# EAGLE design BJ_GIRA_Taster (EAGLE 5.04)
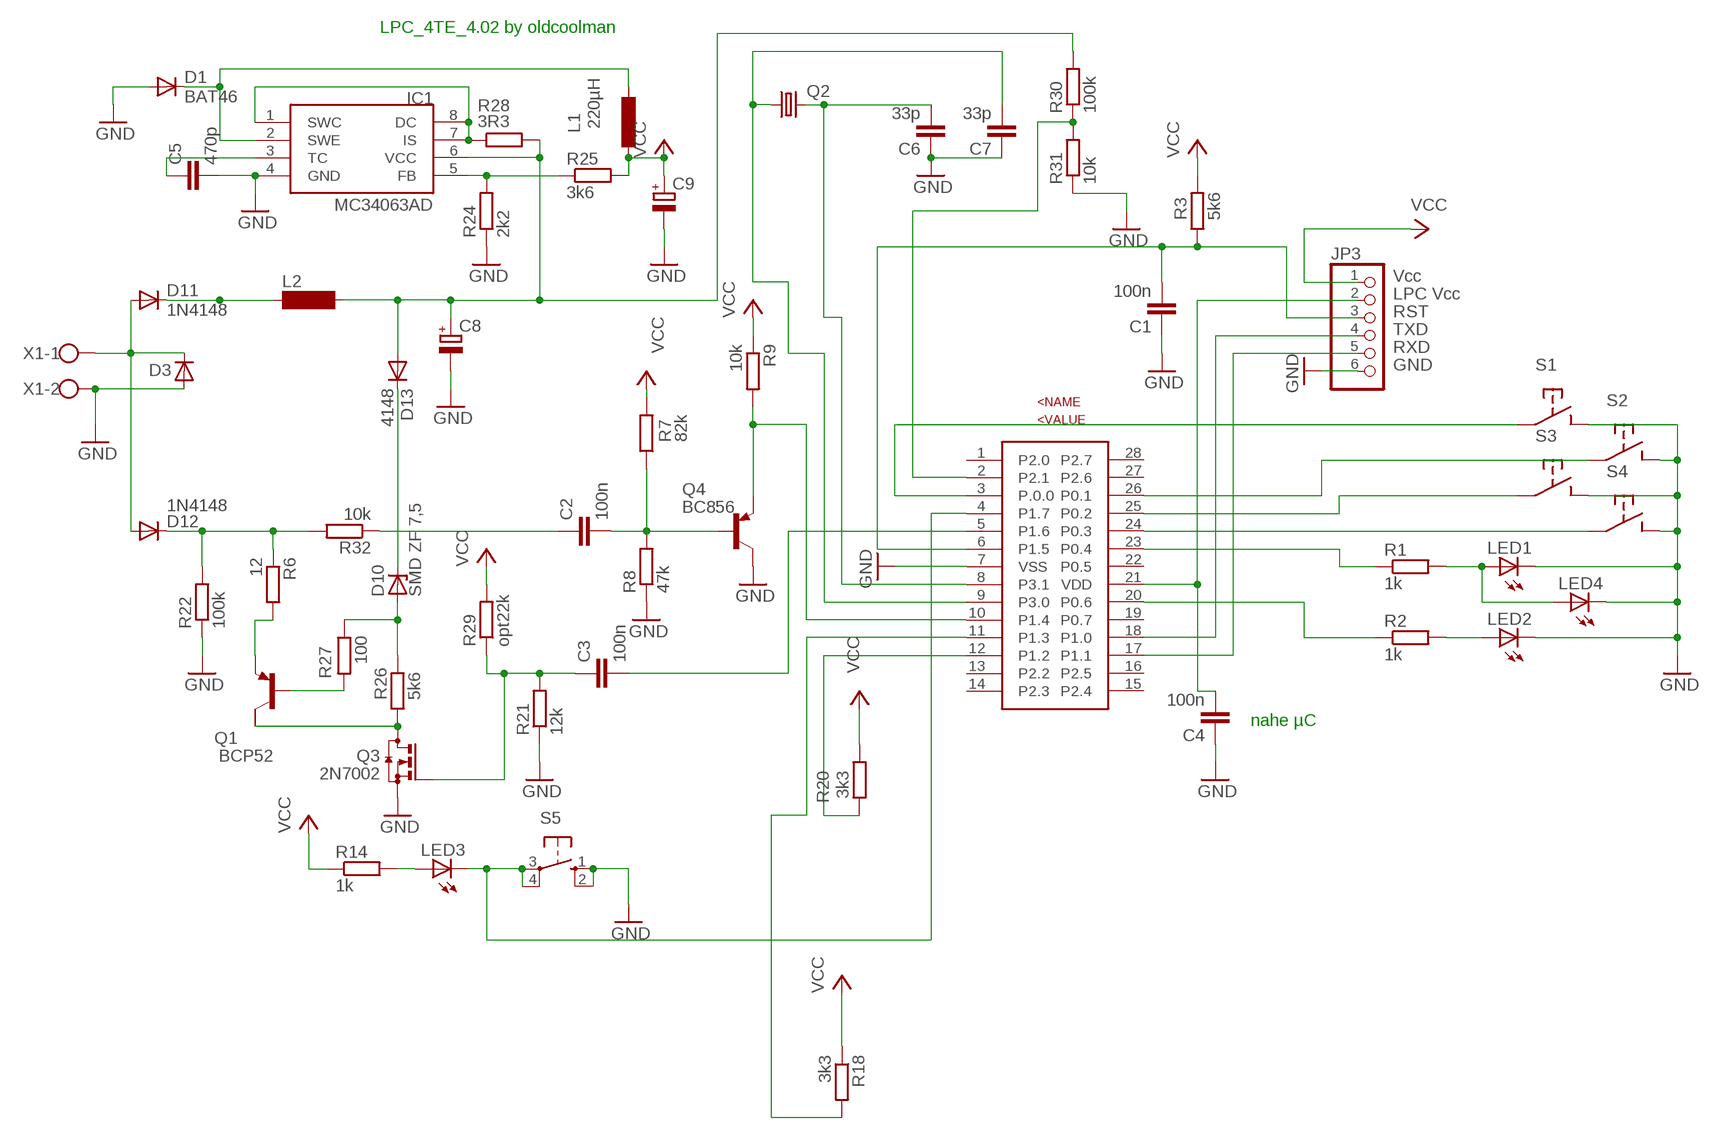
[diagram p0: schematic, sheet 1]

## Parts
C1  100n  C-EUC1206  [C1206]
C2  100n  C-EUC1206  [C1206]
C3  100n  C-EUC1206  [C1206]
C4  100n  C-EUC1206  [C1206]
C5  470p  C-EUC1206  [C1206]
C6  33p  C-EUC1206  [C1206]
C7  33p  C-EUC1206  [C1206]
C8  CPOL-EUE3.5-8  [E3,5-8]
C9  CPOL-EUE2.5-5  [E2,5-5]
D1  BAT46  DIODE-MINIMELF  [MINIMELF]
D3  D-SMB  [SMB]
D10  SMD ZF 7,5  ZPD  [MINIMELF]
D11  1N4148  DIODE-MINIMELF  [MINIMELF]
D12  1N4148  DIODE-MINIMELF  [MINIMELF]
D13  4148  DIODE-MINIMELF  [MINIMELF]
IC1  MC34063AD  [SOIC8]
JP3  PINHD-1X6  [1X06]
L1  220µH  L-EU2200-11.43  [2200-11.43]
L2  BS11  [BS11]
LED1  LED3MM  [LED3MM]
LED2  LED3MM  [LED3MM]
LED3  LED3MM  [LED3MM]
LED4  LED3MM  [LED3MM]
Q1  BCP52  FZT753SMD  [SOT223]
Q2  CRYSTALHC49U-V  [HC49U-V]
Q3  2N7002  BSS123  [SOT23]
Q4  BC856  BC856ALT1SMD  [SOT23-BEC]
R1  1k  R-EU_R1206  [R1206]
R2  1k  R-EU_R1206  [R1206]
R3  5k6  R-EU_M1206  [M1206]
R6  12  R-EU_R1206  [R1206]
R7  82k  R-EU_R1206  [R1206]
R8  47k  R-EU_M1206  [M1206]
R9  10k  R-EU_R1206  [R1206]
R14  1k  R-EU_R1206  [R1206]
R18  3k3  R-EU_R1206  [R1206]
R20  3k3  R-EU_M1206  [M1206]
R21  12k  R-EU_R1206  [R1206]
R22  100k  R-EU_M1206  [M1206]
R24  2k2  R-EU_R1206  [R1206]
R25  3k6  R-EU_M1206  [M1206]
R26  5k6  R-EU_M1206  [M1206]
R27  100  R-EU_R1206  [R1206]
R28  3R3  R-EU_M1206  [M1206]
R29  opt22k  R-EU_R1206  [R1206]
R30  100k  R-EU_R1206  [R1206]
R31  10k  R-EU_R1206  [R1206]
R32  10k  R-EU_R1206  [R1206]
S1  3305  [3305]
S2  3305  [3305]
S3  3305  [3305]
S4  3305  [3305]
S5  10-XX  [B3F-10XX]
U$1  LPC936TSSOP28  [TSSOP28]
X1  W237-02P  [W237-132]

## Nets
EIB+: D3.1(C) D11.A D12.A X1.1
GND: C1.1 C4.1 C5.2 C6.1 C7.1 C8.- C9.- D1.A D3.2(A) IC1.4(GND) JP3.6 LED1.K(C) LED2.K(C) LED4.K(C) Q3.2(S) Q4.C R8.1 R21.1 R22.1 R24.1 R31.1 S1.P$2 S2.P$2 S3.P$2 S4.P$2 S5.1(S) S5.2(S1) U$1.7(VSS) X1.2
N$1: LED1.A LED4.A R1.2
N$2: LED2.A R2.2
N$7: LED3.K(C) S5.3(P) S5.4(P1) U$1.4(P1.7)
N$9: LED3.A R14.2
N$30: Q4.E R9.2 U$1.10(P1.4)
N$31: C2.2 Q4.B R7.1 R8.2
N$33: C3.2 U$1.5(P1.6)
N$34: D12.C R6.1 R22.2 R32.2
N$41: JP3.5 U$1.17(P1.1)
N$42: C1.2 JP3.3 R3.1 U$1.6(P1.5)
N$43: JP3.4 U$1.18(P1.0)
N$44: C4.2 JP3.2 U$1.21(VDD)
N$47: R18.2 U$1.11(P1.3)
N$48: C3.1 Q3.1(G) R21.2 R29.1
N$50: IC1.5(FB) R24.2 R25.1
N$51: D1.C IC1.2(SWE) L1.2
N$52: C5.1 IC1.3(TC)
N$53: D11.C L2.1
N$54: Q1.2(C) Q3.3(D) R26.1
N$55: D10.A R26.2 R27.1
N$56: Q1.3(E) R6.2
N$57: Q1.1(B) R27.2
N$58: D10.C D13.C
N$59: C6.2 Q2.2 U$1.8(P3.1)
N$63: IC1.1(SWC) IC1.7(IS) IC1.8(DC) R28.1
N$71: R20.2 U$1.12(P1.2)
N$72: C8.+ D13.A IC1.6(VCC) L2.2 R28.2 R30.2
N$75: R30.1 R31.2 U$1.2(P2.1)
N$76: C7.2 Q2.1 U$1.9(P3.0)
N$77: C2.1 R32.1
P0.0: S1.P$1 U$1.3(P.0.0)
P0.1: S2.P$1 U$1.26(P0.1)
P0.2: S3.P$1 U$1.25(P0.2)
P0.3: S4.P$1 U$1.24(P0.3)
P0.4: R1.1 U$1.23(P0.4)
P0.6: R2.1 U$1.20(P0.6)
VCC: C9.+ JP3.1 L1.1 R3.2 R7.2 R9.1 R14.1 R18.1 R20.1 R25.2 R29.2
Unconnected: Q1.4(C/) U$1.1(P2.0) U$1.13(P2.2) U$1.14(P2.3) U$1.15(P2.4) U$1.16(P2.5) U$1.19(P0.7) U$1.22(P0.5) U$1.27(P2.6) U$1.28(P2.7)

## Notes on the sheet
- LPC_4TE_4.02 by oldcoolman
- Vcc
- LPC Vcc
- RST
- TXD
- RXD
- GND
- nahe µC

## Library data of the parts
C1-C7 = rcl:C-EU: CAPACITOR, European symbol
C8 C9 = rcl:CPOL-EU: POLARIZED CAPACITOR, European symbol
D1 D11-D13 = diode:DIODE-: DIODE
D3 = semicon-smd-ipc:D-: DIODE unfilled
D10 = diode:ZPD: Z DIODE 500 mW
IC1 = mc34063:MC34063
JP3 = pinhead:PINHD-1X6: PIN HEADER
L1 = rcl:L-EU: INDUCTOR, European symbol
L2 = inductor-neosid:BS: INDUCTOR nominal inductance, magnetically screened
LED1-LED4 = led:LED: LED OSRAM: - CHIPLED LG R971, LG N971, LY N971, LG Q971, LY Q971, LO R971, LY R971 LH N974, LH R974 LS Q976, LO Q976, LY Q976 LO Q996 - Hyper CHIPLED LW Q18S LB Q993, LB Q99A, LB R99A - SideLED LS A670, LO A670, LY A670, LG A670, LP A670 LB A673, LV A673, LT A673, LW A673 LH A674 LY A675 LS A676, LA A676, LO A676, LY A676, LW A676 LS A679, LY A679, LG A679 - Hyper Micro SIDELED® LS Y876, LA Y876, LO Y876, LY Y876 LT Y87S - SmartLED LW L88C, LW L88S LB L89C, LB L89S, LG L890 LS L89K, LO L89K, LY L89K LS L896, LA L896, LO L896, LY L896 - TOPLED LS T670, LO T670, LY T670, LG T670, LP T670 LSG T670, LSP T670, LSY T670, LOP T670, LYG T670 LG T671, LOG T671, LSG T671 LB T673, LV T673, LT T673, LW T673 LH T674 LS T676, LA T676, LO T676, LY T676, LB T676, LH T676, LSB T676, LW T676 LB T67C, LV T67C, LT T67C, LS T67K, LO T67K, LY T67K, LW E67C LS E67B, LA E67B, LO E67B, LY E67B, LB E67C, LV E67C, LT E67C LW T67C LS T679, LY T679, LG T679 LS T770, LO T770, LY T770, LG T770, LP T770 LB T773, LV T773, LT T773, LW T773 LH T774 LS E675, LA E675, LY E675, LS T675 LS T776, LA T776, LO T776, LY T776, LB T776 LHGB T686 LT T68C, LB T68C - Hyper Mini TOPLED® LB M676 - Mini TOPLED Santana® LG M470 LS M47K, LO M47K, LY M47K Source: http://www.osram.convergy.de - LUMILED® LXK2-PW12-R00, LXK2-PW12-S00, LXK2-PW14-U00, LXK2-PW14-V00 LXK2-PM12-R00, LXK2-PM12-S00, LXK2-PM14-U00 LXK2-PE12-Q00, LXK2-PE12-R00, LXK2-PE12-S00, LXK2-PE14-T00, LXK2-PE14-U00 LXK2-PB12-K00, LXK2-PB12-L00, LXK2-PB12-M00, LXK2-PB14-N00, LXK2-PB14-P00, LXK2-PB14-Q00 LXK2-PR12-L00, LXK2-PR12-M00, LXK2-PR14-Q00, LXK2-PR14-R00 LXK2-PD12-Q00, LXK2-PD12-R00, LXK2-PD12-S00 LXK2-PH12-R00, LXK2-PH12-S00 LXK2-PL12-P00, LXK2-PL12-Q00, LXK2-PL12-R00 Source: www.luxeon.com
Q1 = transistor-pnp:FZT753SMD: PNP Transistor
Q2 = crystal:CRYSTAL: CRYSTAL
Q3 = transistor-small-signal:BSS123: N-CHANNEL MOS FET
Q4 = transistor-pnp:BC856*: PNP Transistror
R1-R3 R6-R9 R14 R18 R20-R22 R24-R32 = rcl:R-EU_: RESISTOR, European symbol
S1-S4 = kubi:3305: Taster 3305
S5 = switch-omron:10-XX: OMRON SWITCH
U$1 = freebuslpc:LPC936: C51 Based Microcontroller LPC936 ADC and 16kbyte Flash
X1 = con-wago-508:W237-02P: WAGO SREW CLAMP

## Board
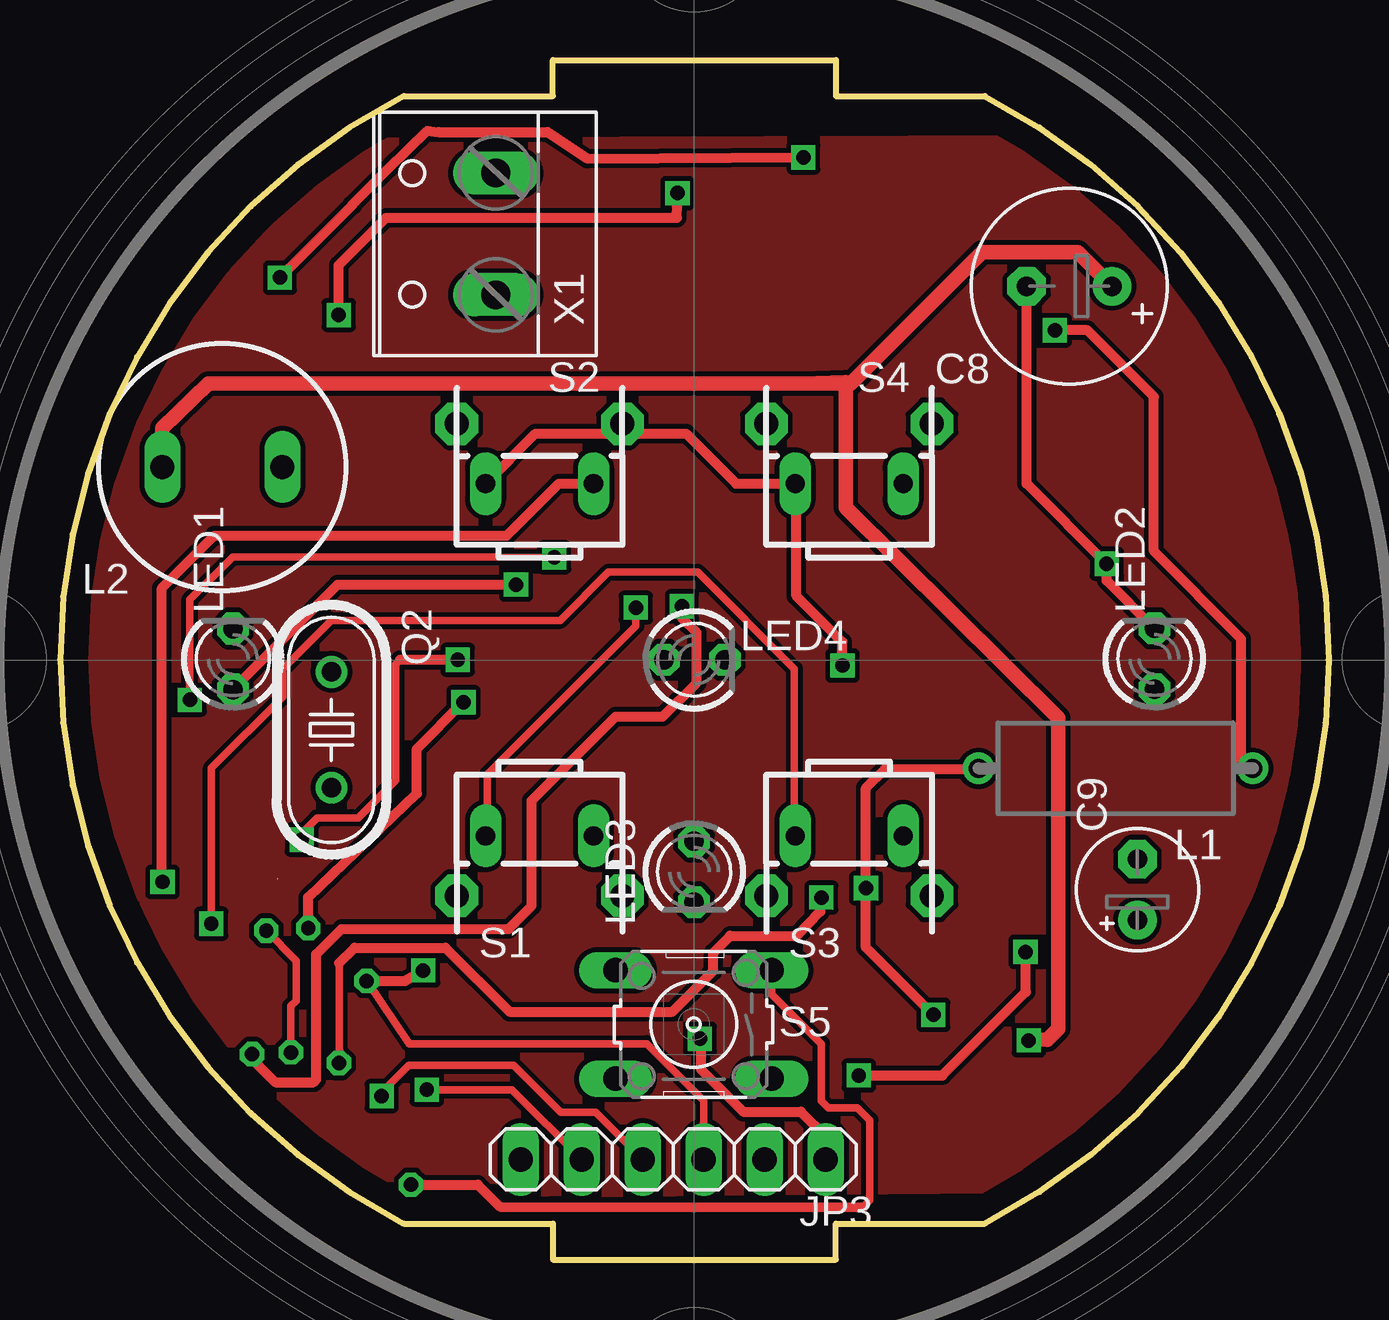
[diagram p1: board, top side]
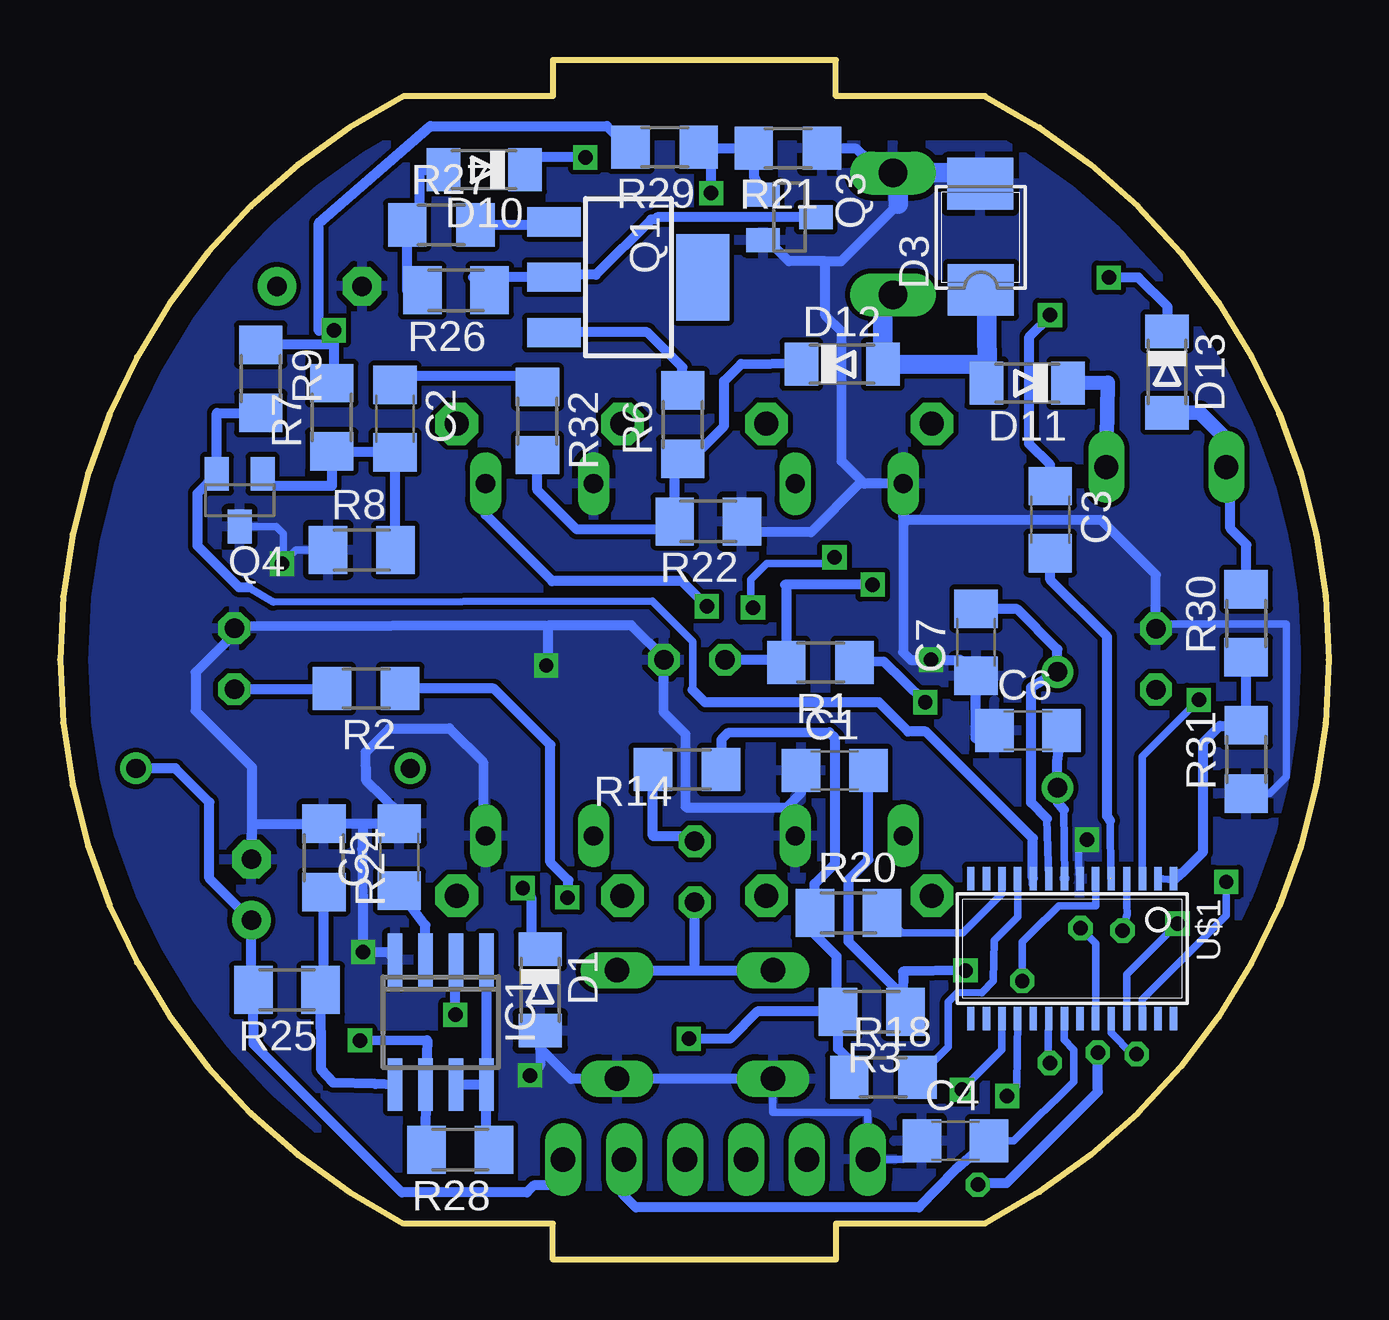
[diagram p2: board, bottom side, seen from below]

Size 52.86 x 50 mm. Coordinates in mm from the lower left corner, seen from the top.
Outline: 20.53,48.5 20.53,50 32.33,50 32.33,48.5 38.53,48.5 arc-126 38.53,1.5 32.33,1.5 32.33,0 20.53,0 20.53,1.5 14.33,1.5 arc-126 14.33,48.5 20.53,48.5
Copper layers (1*16): Top 0.035mm / dielectric 1.5mm / Bottom 0.035mm
Design rules "default": minimum track width 10mil, minimum drill 24mil, track to track 8mil, track to pad 8mil, pad to pad 8mil, via to via 8mil, smd to smd 8mil, copper to edge 40mil, drill to drill 8mil, minimum pad ring 10mil, minimum via ring 8mil, stop-mask expansion 4mil, vias tented up to drill 0mil, thermal gap 10mil
tKeepout: area 3.2,37.4 to 11.1,41.4; area 41.9,37.4 to 49.5,41.4; area 4.1,9.5 to 11.6,13.4; area 41.9,8.6 to 49.5,12.6

### Footprints (pad centres in the part's own frame; a part is rotated, then mirrored left to right if it is on the bottom)
C1206 = smd 1.6 x 1.8: 1 -1.4,0; 2 1.4,0
E3,5-8 = drill 0.813 pad 1.6 round: + -1.778,0 | drill 0.813 pad 1.6 octagon: - 1.778,0
E2,5-5 = drill 0.813 pad 1.6 round: + -1.27,0 | drill 0.813 pad 1.6 octagon: - 1.27,0
MINIMELF = smd 1.4 x 1.8: A 1.7,0; C -1.7,0
SMB = smd 2.159 x 2.743: 1 -2.311,-0.127; 2 2.108,-0.102
SOIC8 = smd 0.6 x 2.2: 1 -1.905,-2.6; 2 -0.635,-2.6; 3 0.635,-2.6; 4 1.905,-2.6; 5 1.905,2.6; 6 0.635,2.6; 7 -0.635,2.6; 8 -1.905,2.6
1X06 = drill 1.016 long: 1 -6.35,0; 2 -3.81,0; 3 -1.27,0; 4 1.27,0; 5 3.81,0; 6 6.35,0
2200-11.43 = drill 0.8 pad 1.27 round: 1 -5.715,0; 2 5.715,0
BS11 = drill 1 long: 1 -2.5,0; 2 2.5,0
LED3MM = drill 0.813 octagon: A -1.27,0; K 1.27,0
SOT223 = smd 1.219 x 2.235: 1 -2.311,-3.099; 2 0,-3.099; 3 2.311,-3.099 | smd 3.6 x 2.2: 4 0,3.099
HC49U-V = drill 0.813 round: 1 -2.413,0; 2 2.413,0
SOT23 = smd 1 x 1.4: 1 -0.95,-1.1; 2 0.95,-1.1; 3 0,1.1
SOT23-BEC = smd 1 x 1.4: B -0.95,-1.1; C 0,1.1; E 0.95,-1.1
R1206 = smd 1.6 x 1.803: 1 -1.422,0; 2 1.422,0
M1206 = smd 1.6 x 2: 1 -1.4,0; 2 1.4,0
3305 = drill 0.8 long: P$1 -2.25,0; P$2 2.25,0 | drill 1 pad 1.778 octagon: P$3 -3.45,-2.5; P$4 3.45,-2.5
B3F-10XX = drill 1.016 long: 1 -3.251,2.261; 2 3.251,2.261; 3 -3.251,-2.261; 4 3.251,-2.261
TSSOP28 = smd 0.305 x 0.991: 1 -4.225,-2.918; 2 -3.575,-2.918; 3 -2.925,-2.918; 4 -2.275,-2.918; 5 -1.625,-2.918; 6 -0.975,-2.918; 7 -0.325,-2.918; 8 0.325,-2.918; 9 0.975,-2.918; 10 1.625,-2.918; 11 2.275,-2.918; 12 2.925,-2.918; 13 3.575,-2.918; 14 4.225,-2.918; 15 4.225,2.918; 16 3.575,2.918; 17 2.925,2.918; 18 2.275,2.918; 19 1.625,2.918; 20 0.975,2.918; 21 0.325,2.918; 22 -0.325,2.918; 23 -0.975,2.918; 24 -1.625,2.918; 25 -2.275,2.918; 26 -2.925,2.918; 27 -3.575,2.918; 28 -4.225,2.918
W237-132 = drill 1.194 long: 1 -2.54,-0.635; 2 2.54,-0.635

### Placement (x,y rotation side)
C1  20.58,20.39 0 bottom
C2  38.91,35.05 270 bottom
C3  11.6,30.84 270 bottom
C4  15.55,4.95 0 bottom
C5  38.72,16.77 90 bottom
C6  12.53,22.05 0 bottom
C7  14.7,25.73 90 bottom
C8  42.05,40.57 180 top
C9  44.89,15.41 90 top
D1  32.86,11.24 270 bottom
D3  14.62,42.73 90 bottom
D10  35.19,45.42 180 bottom
D11  12.56,36.53 180 bottom
D12  20.28,37.32 0 bottom
D13  6.74,36.99 270 bottom
IC1  37,9.89 180 bottom
JP3  25.55,4.17 180 top
L1  43.98,20.47 180 top
L2  6.76,33.04 180 top
LED1  7.2,25.03 90 top
LED2  45.6,25.04 90 top
LED3  26.42,16.16 270 top
LED4  26.43,25 0 top
Q1  29.18,40.94 270 bottom
Q2  11.31,22.08 270 top
Q3  22.47,43.44 270 bottom
Q4  45.38,31.65 180 bottom
R1  21.18,24.89 180 bottom
R2  40.11,23.8 180 bottom
R3  19.04,10.33 180 bottom
R6  26.92,34.8 90 bottom
R7  41.54,35.11 90 bottom
R8  40.29,29.58 0 bottom
R9  44.5,36.71 270 bottom
R14  26.74,20.42 180 bottom
R18  18.56,7.59 0 bottom
R20  20.01,14.45 0 bottom
R21  22.53,46.33 180 bottom
R22  25.85,30.77 180 bottom
R24  41.87,16.74 270 bottom
R25  43.4,11.24 180 bottom
R26  36.37,40.4 180 bottom
R27  36.98,43.12 0 bottom
R28  36.19,4.58 180 bottom
R29  27.67,46.36 180 bottom
R30  3.44,26.52 90 bottom
R31  3.43,20.84 90 bottom
R32  32.97,34.95 270 bottom
S1  19.98,17.66 0 top
S2  19.98,32.34 180 top
S3  32.88,17.66 0 top
S4  32.88,32.34 180 top
S5  26.4,9.8 180 top
U$1  10.69,12.96 180 bottom
X1  17.52,42.75 90 top

### Tracks (layer width: path | path; a pad name or v marks a point on that pad's centre or on a via)
EIB+
  Bottom 0.406: 18.59,40.1 X1.1 | 14.22,37.31 14.21,36.55 D11.A | 14.26,40.1 D3.1
  Bottom 0.813: 18.59,40.1 D12.A 14.22,37.31 14.26,40.1
GND  (via drill 0.6)
  Top 0.305: v10.07,17.5 10.17,17.67 10.19,17.89 10.71,18.41 12.43,18.41 13.99,19.97 13.99,24.82 14.17,25
  Top 0.406: LED2.K 43.61,28.3 v43.61,29 40.27,32.34 C8.- | v16.57,25 14.17,25 | v33.28,7.67 36.76,7.67 40.24,11.15 v40.24,12.81 v40.23,12.82 | S4.P$2 28.17,32.34 26.09,34.42 19.81,34.42 S2.P$2 | 30.65,32.36 30.68,32.33 30.68,27.66 32.6,25.74 v32.6,24.76
  Bottom 0.305: U$1.7 10.38,15.89 10.41,16.43 10.41,17.22 v10.07,17.5 | R31.1 2.46,19.42 1.77,20.11 1.77,26.5 7,26.5 LED1.K | R8.1 43.03,29.58 v43.61,29 43.57,29.04 43.57,30.26 43.86,30.55 Q4.C | C4.1 17.73,4.17 JP3.6 19.2,6.13 19.21,6.14 23.16,6.14 S5.2 | S1.P$2 22.23,18.46 22.6,18.83 | 35.23,18.56 35.23,17.76 S3.P$2
  Bottom 0.406: LED2.K 45.84,26.55 | LED2.K 45.6,26.08 47.21,24.47 47.21,22.87 44.87,20.53 44.87,16.7 C9.- 44.86,18.16 R24.1 41.71,18.17 40.24,18.17 | 40.24,18.17 C5.2 38.69,18.57 40.1,19.95 40.13,21.14 39.13,22.14 36.64,22.14 35.23,20.73 35.23,18.56 | 40.24,18.17 40.27,17.09 40.24,13.39 | 32.54,26.42 29.05,26.43 27.67,25.05 LED4.K 27.7,22.8 26.79,21.89 26.79,18.88 26.74,18.83 22.6,18.83 21.98,19.45 C1.1 | 32.54,26.42 45.53,26.38 LED2.K | S5.2 S5.1 29.67,7.53 31.58,7.53 32.86,8.81 D1.A 32.86,8.09 v33.28,7.67 | C7.1 14.72,24.3 14.72,21.73 C6.1 | C7.1 14.73,24.36 | LED1.K 7.2,28.55 9.47,30.82 17.54,30.82 17.73,31.01 | 17.73,31.01 17.73,25.31 17.42,25 v16.57,25 15.37,25 C7.1 | 17.93,45.12 X1.2 19.42,46.04 19.68,46.3 21.08,46.3 R21.1 | 38.96,12.74 IC1.4 39.23,12.82 v40.23,12.82 | 19.35,32.34 19.55,32.34 21.57,30.32 24,30.32 R22.1 | Q3.2 23.38,42.49 22.49,41.61 20.97,41.61 | 17.93,44 20.32,41.61 20.97,41.61 | 20.97,41.61 20.97,39.35 20.29,38.67 20.29,33.28 19.35,32.34 | 19.35,32.34 S2.P$2 17.73,31.01 | v32.6,24.76 32.54,24.82 32.54,26.42
  Bottom 0.813: 17.93,44 17.93,45.12 | D3.2 14.52,44.95 14.88,45.31 18.14,45.31 X1.2
  pour Bottom: 12.24,46.33 12.34,46.43 40.68,46.43 45.77,42.82 49.38,37.93 51.93,32.09 52.88,25.39 52.03,18.38 49.17,11.37 45.67,6.8 41.21,3.08 39.51,3.08 11.71,3.08 5.77,8.28 2.37,14.13 0.14,21.36 0.57,30.39 3.01,37.4 6.51,42.4 10.01,45.58
N$1  (via drill 0.6)
  Top 0.406: LED1.A 11.57,28.13 v19,28.13
  Bottom 0.406: v19,28.13 22.65,28.13 22.6,28.08 R1.2 22.71,25 LED4.A
N$2
  Bottom 0.406: LED2.A 41.56,23.77 R2.2
N$3
  pour Top: 11.29,46.58 41.35,46.67 46.57,42.15 50.72,35.61 52.85,27.11 52.67,20.48 50.81,14.73 46.3,7.39 41.09,2.96 12.44,2.7 6.33,7.83 2.44,13.93 0.23,21.36 0.5,30.56 2.8,37.02 6.69,42.6 10.93,46.4
N$7  (via drill 0.6)
  Top 0.305: 33.45,2.17 33.74,2.46 33.74,5.81 33.22,6.33 32,6.33 31.72,6.61 31.72,8.99 29.66,11.06 S5.3 | v8.59,13.71 9.85,12.45 9.85,10.78 9.61,10.57 v9.62,8.63
  Top 0.406: v14.62,3.12 17.41,3.12 18.33,2.2 33.45,2.17
  Bottom 0.305: U$1.4 8.41,14.78 8.39,14.41 v8.59,13.71 | v14.62,3.12 14.6,3.1
  Bottom 0.406: 26.46,12.06 S5.4 | S5.3 26.46,12.06 | LED3.K 26.42,12.1 26.46,12.06 | v9.62,8.63 9.62,6.99 13.43,3.18 14.56,3.18 v14.62,3.12
N$9
  Bottom 0.406: LED3.A 26.63,17.64 28.14,17.64 28.16,17.66 R14.2
N$30
  Bottom 0.305: U$1.10 12.35,15.64 12.33,15.9 | 26.5,23.74 26.5,25.76 28.19,27.45 43.98,27.4 45,28.02
  Bottom 0.406: 45,28.02 45.4,28.02 47.13,29.75 47.13,31.94 Q4.E 46.33,35.29 R9.2 | 12.33,15.9 12.33,17.56 16.78,22.01 17.52,22.01 18.73,23.22 25.98,23.22 26.5,23.74
N$31
  Bottom 0.406: Q4.B 44.43,32.25 41.53,32.25 R7.1 41.54,33.65 C2.2 38.91,29.58 R8.2
N$33  (1 unrouted)
  Bottom 0.305: 9.08,15.89 9.11,18.3
  Bottom 0.406: C3.2 11.6,28.33 9.23,25.96 9.23,18.47 9.11,18.3
N$34
  Bottom 0.406: 21.89,37.48 D12.C 21.99,37.36 24.48,37.33 25.19,36.62 25.19,34.75 27.25,32.69 R22.2 | R6.1 27.25,33.38 R22.2 | R32.2 32.97,32.07 31.33,30.43 27.59,30.43 R22.2
N$41  (via drill 0.6)
  Top 0.305: v15.28,7.08 18.83,7.08 JP3.5
  Bottom 0.305: U$1.17 13.62,8.75 v15.28,7.08
N$42  (via drill 0.6)
  Top 0.305: JP3.3 26.82,6.61 24.45,9 14.55,9 v12.77,11.61
  Top 0.406: v15.13,12.05 14.37,11.61 v12.77,11.61
  Bottom 0.305: 12.8,11.59 v12.77,11.61 12.77,13.23 12.37,13.63 11.27,14.72 11.25,14.74 9.72,14.74 9.71,14.73 U$1.6
  Bottom 0.406: C1.2 19.18,16.66 20,15.84 20,13.24 17.74,10.98 | 17.74,10.98 17.66,10.9 17.66,10.35 R3.1 | v15.13,12.05 17.73,12.01 17.74,10.98
N$43  (via drill 0.6)
  Top 0.305: v13.4,6.81 13.4,6.97 14.52,8.09 18.9,8.09 20.86,6.13 22.32,6.13 JP3.4
  Bottom 0.305: U$1.18 13,7.22 v13.4,6.81
N$44
  Bottom 0.305: U$1.21 11.03,9.15 10.63,8.74 10.63,7.4 11.23,6.8 12.08,6 13.13,4.95 C4.2
  Bottom 0.406: C4.2 15.56,3.74 17.08,2.17 28.87,2.17 29.4,2.7 29.4,4.13 JP3.2
N$47
  Bottom 0.305: 16.78,7.7 R18.2 15.85,8.88 15.85,10.73 15.45,11.13 14.46,11.12 13.97,11.61 13.93,13.31 12.97,14.28 U$1.11
N$48  (via drill 0.6)
  Top 0.406: v25.73,44.45 25.7,43.42 13.59,43.42 11.61,41.44 v11.61,39.37
  Bottom 0.406: C3.1 11.61,33.13 12.48,34 12.47,38.46 11.61,39.32 v11.61,39.37 | Q3.1 23.96,45.13 R21.2 25.73,46.33 | 25.73,46.33 26.21,46.33 R29.1 | v25.73,44.45 25.73,46.33
N$50
  Bottom 0.406: R24.2 41.87,11.38 R25.1 | R25.1 41.82,11.24 | IC1.5 39.72,7.32 41.48,7.37 41.98,7.91 R25.1
N$51  (via drill 0.6)
  Top 0.406: L1.2 38.25,20.45 34.38,20.45 33.58,19.65 v33.58,15.48 33.58,13.01 v36.39,10.2
  Bottom 0.406: D1.C 32.86,12.97 33.22,13.28 33.23,15.1 v33.58,15.48 | v36.39,10.2 36.39,12.46 IC1.2
N$52
  Bottom 0.406: IC1.3 37.64,13.93 C5.1
N$53
  Bottom 0.61: L2.1 9.21,36.56 D11.C
N$54
  Bottom 0.406: R26.1 35.67,40.94 Q1.2 32.17,41.05 30.53,41.05 28.23,43.35 28.08,43.35 27.99,43.44 Q3.3
N$55
  Bottom 0.406: D10.A 36.89,45.4 37.88,45.4 37.88,43.12 R27.1 38.4,40.4 R26.2
N$56
  Bottom 0.406: Q1.3 32.28,38.65 28.4,38.65 26.93,37.19 R6.2
N$57
  Bottom 0.406: Q1.1 32.28,43.12 R27.2
N$58  (via drill 0.6)
  Top 0.406: v30.97,45.94 21.97,45.89 20.3,47 15.77,47 15.31,47.05 13.67,45.46 12.16,43.95 12.18,43.95 | 12.18,43.95 12.19,43.95 | v9.16,40.93 12.18,43.95
  Bottom 0.406: 33.01,45.42 D10.C 33.43,45.42 33.43,45.95 v30.97,45.95 v30.97,45.94 | v9.16,40.93 7.93,40.93 6.71,39.71 6.71,38.72 D13.C
N$59
  Bottom 0.305: 11,15.89 11.03,18.76
  Bottom 0.406: 11.03,18.76 11.31,19.09 Q2.2 11.32,19.16 11.32,20.76 C6.2 | U$1.8 11,15.89
N$63
  Bottom 0.406: IC1.8 IC1.1 | IC1.8 IC1.7 | R28.1 34.5,5.22 35.11,5 35.11,7.04 IC1.8
N$71
  Bottom 0.305: U$1.12 13.62,15.24 14.49,14.36 14.5,14.36 15.25,13.61 17.77,13.61 R20.2
N$72  (via drill 0.6)
  Top 0.61: v40.36,9.13 40.4,9.19 41.13,9.15 41.59,9.61 41.59,22.57 32.73,31.35 32.73,36.57 30.87,36.51 | 30.87,36.51 6.17,36.51 4.25,34.65 4.25,33 L2.2 | 30.87,36.51 32.95,36.51 38.43,42 42.4,42 C8.+
  Bottom 0.406: v40.36,9.13 37.57,9.15 IC1.6 37.64,4.7 R28.2 | 4.12,32.98 L2.2 4.1,32.98 4.1,30.47 3.43,29.8 3.43,27.95 R30.2
  Bottom 0.61: D13.A 5.37,35.29 4.1,34.03 4.1,33 L2.2
N$75
  Bottom 0.305: 6.45,15.82 U$1.2
  Bottom 0.406: 6.45,15.82 6.19,16.08 6.15,16.08 5.23,17 5.23,21.55 4.53,22.25 3.45,22.25 R31.2 R30.1
N$76
  Bottom 0.305: U$1.9 11.75,18.38
  Bottom 0.406: C7.2 14.68,27.11 12.98,27.11 11.31,25.44 Q2.1 12.4,23.86 12.4,19.05 11.75,18.38
N$77
  Bottom 0.406: R32.1 33.08,36.37 33.52,36.82 38.54,36.82 C2.1
P0.0  (via drill 0.6)
  Top 0.305: v5.41,23.33 5.41,27.51 7.19,29.29 18.33,29.29 v20.59,29.27 | v23.99,27.17 23.99,26.41 17.8,20.22 17.8,17.73 S1.P$1
  Bottom 0.305: U$1.3 7.77,20.98 v5.41,23.33 | v20.59,29.27 20.75,29.24 21.03,29.02 23.42,29.02 24.09,28.35 24.09,27.27 v23.99,27.17
P0.1  (via drill 0.6)
  Top 0.406: S2.P$1 20.78,32.34 18.61,30.17 6.43,30.17 4.24,27.98 4.24,15.77 v4.27,15.74
  Bottom 0.305: v4.27,15.74 4.27,14.34 7.76,10.85 U$1.26
P0.2  (via drill 0.6)
  Top 0.305: v6.3,14 6.3,20.48 9.27,23.45 9.27,24.62 11.29,26.64 20.84,26.64 22.85,28.65 26.57,28.65 30.6,24.62 30.6,17.69 S3.P$1
  Bottom 0.305: U$1.25 8.42,11.89 v6.3,14
P0.3  (via drill 0.6)
  Top 0.406: v25.91,27.23 25.91,26.74 26.52,26.13 26.52,24.04 25.11,22.63 23.15,22.63 19.65,19.13 19.65,14.74 18.69,13.78 11.73,13.78 10.67,12.72 10.67,7.49 10.57,7.39 8.96,7.39 8,8.35 v8,8.56
  Bottom 0.305: v8,8.56 8.18,8.56 9.07,9.45 U$1.24
  Bottom 0.406: S4.P$1 35.13,31.05 32.36,28.28 26.96,28.28 v25.91,27.23
P0.4  (via drill 0.6)
  Top 0.406: v16.81,23.23 14.87,21.29 14.87,19.42 10.34,15.1 v10.34,13.81
  Bottom 0.305: v10.34,13.81 9.72,13.18 U$1.23
  Bottom 0.406: R1.1 18.54,24.92 v16.81,23.23
P0.6  (via drill 0.6)
  Top 0.305: 11.63,12.36 v11.63,8.2 v11.62,8.19
  Top 0.406: v31.72,15.09 31.68,14.51 30.69,13.49 27.92,13.49 27.21,12.78 27.21,12.03 25.51,10.33 18.73,10.33 16.06,13 12.27,13 11.63,12.36
  Bottom 0.305: 11.68,8.3 11.68,9.14 U$1.20
  Bottom 0.406: v11.62,8.19 11.57,8.19 11.68,8.3 | R2.1 34.78,23.8 32.43,21.45 32.43,16.56 31.68,15.81 31.68,15.38 v31.72,15.09
VCC  (via drill 0.6)
  Top 0.406: v41.45,38.73 42.81,38.73 45.58,35.96 45.58,29.54 49.21,25.86 49.21,20.48 L1.1 | v26.66,9.2 26.7,9.16 26.7,7.93 28.47,6.16 30.87,6.16 31.9,5.13 JP3.1
  Bottom 0.406: L1.1 48.06,20.47 46.64,19.06 46.64,15.89 C9.+ 44.89,11.33 R25.2 44.8,9.86 44.79,9.85 44.79,8.97 38.62,2.8 33.41,2.8 33.12,3.09 31.95,3.09 31.95,4.12 JP3.1 | R3.2 20.22,10.16 20.36,10.12 | 29.09,46.26 R29.2 | 29.09,46.26 29.09,46.19 | 29.09,46.26 30.08,47.25 37.43,47.25 42.08,43.2 42.08,38.7 v41.45,38.73 41.45,38.15 | 41.45,38.15 41.45,36.62 R7.2 | R9.1 41.47,38.13 41.45,38.15 | R14.1 25.31,21.67 25.04,21.94 20.81,21.97 20.57,21.73 20.57,16.51 21.42,15.66 21.42,14.46 R20.1 21.41,13.55 20.5,12.64 20.5,10.39 R3.2 | v26.66,9.2 24.94,9.2 23.8,10.34 R3.2 | R18.1 19.98,8.32 20.44,8.78 R3.2

### Text on the board
Mechanik: Material Edelstahl 0,8mm | Einheit ist mm Aussenmasse (70.8x70.8)